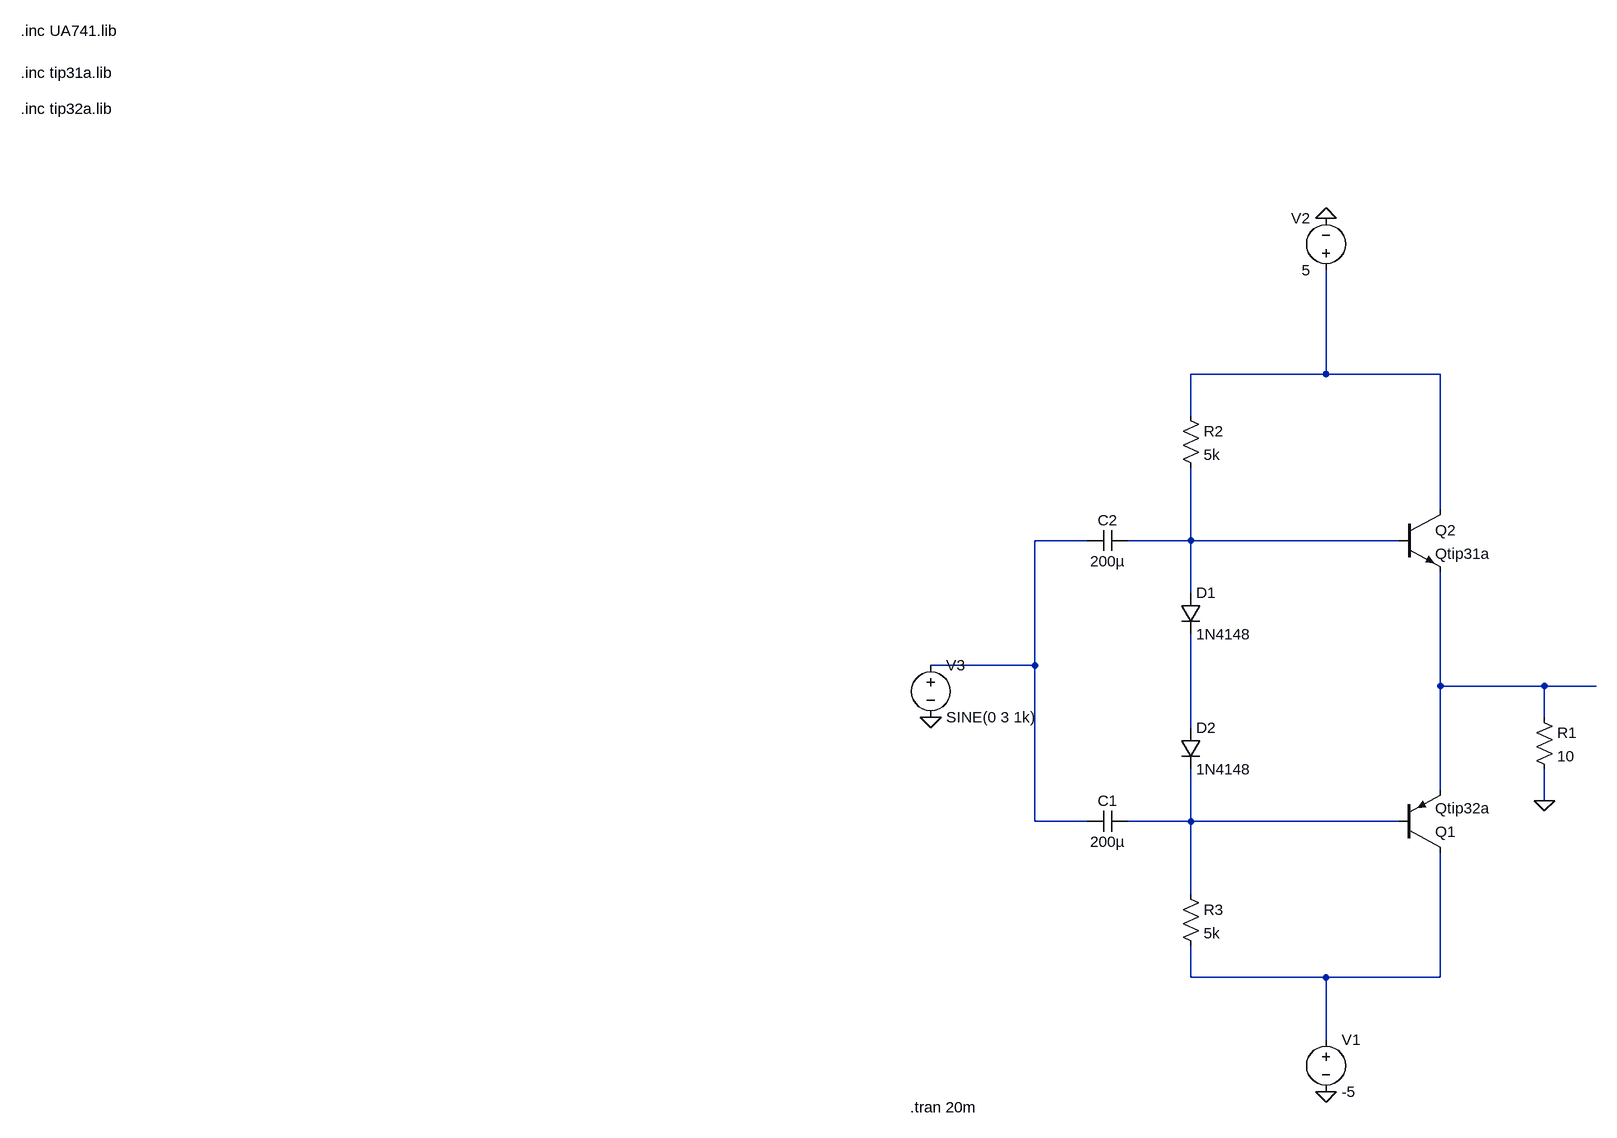
[diagram p0: schematic 4th-stage(pow_amp).asc]
4th-stage(pow_amp).asc, the LTspice schematic file:
Version 4.1
SHEET 1 880 808
WIRE 240 -336 240 -496
WIRE 240 -336 32 -336
WIRE 416 -336 240 -336
WIRE 32 -272 32 -336
WIRE 416 -128 416 -336
WIRE -128 -80 -208 -80
WIRE 32 -80 32 -192
WIRE 32 -80 -64 -80
WIRE 352 -80 32 -80
WIRE 32 0 32 -80
WIRE -208 112 -208 -80
WIRE -208 112 -368 112
WIRE 416 144 416 -32
WIRE 576 144 416 144
WIRE 656 144 576 144
WIRE 576 192 576 144
WIRE 32 208 32 64
WIRE 416 304 416 144
WIRE 576 320 576 272
WIRE -208 352 -208 112
WIRE -128 352 -208 352
WIRE 32 352 32 272
WIRE 32 352 -64 352
WIRE 352 352 32 352
WIRE 32 464 32 352
WIRE 32 592 32 544
WIRE 240 592 32 592
WIRE 416 592 416 400
WIRE 416 592 240 592
WIRE 240 688 240 592
FLAG 576 320 0
FLAG 240 -576 0
FLAG 240 768 0
FLAG -368 192 0
SYMBOL pnp 352 400 M180
SYMATTR InstName Q1
SYMATTR Value Qtip32a
SYMBOL npn 352 -128 R0
SYMATTR InstName Q2
SYMATTR Value Qtip31a
SYMBOL res 560 176 R0
SYMATTR InstName R1
SYMATTR Value 10
SYMBOL res 16 -288 R0
SYMATTR InstName R2
SYMATTR Value 5k
SYMBOL res 16 448 R0
SYMATTR InstName R3
SYMATTR Value 5k
SYMBOL diode 16 0 R0
SYMATTR InstName D1
SYMATTR Value 1N4148
SYMBOL diode 16 208 R0
SYMATTR InstName D2
SYMATTR Value 1N4148
SYMBOL cap -64 336 R90
WINDOW 0 0 32 VBottom 2
WINDOW 3 32 32 VTop 2
SYMATTR InstName C1
SYMATTR Value 200µ
SYMBOL cap -64 -96 R90
WINDOW 0 0 32 VBottom 2
WINDOW 3 32 32 VTop 2
SYMATTR InstName C2
SYMATTR Value 200µ
SYMBOL voltage 240 672 R0
SYMATTR InstName V1
SYMATTR Value -5
SYMBOL voltage 240 -480 R180
WINDOW 0 24 96 Left 2
WINDOW 3 24 16 Left 2
SYMATTR InstName V2
SYMATTR Value 5
SYMBOL voltage -368 96 R0
WINDOW 123 0 0 Left 0
WINDOW 39 0 0 Left 0
SYMATTR InstName V3
SYMATTR Value SINE(0 3 1k)
TEXT -400 792 Left 2 !.tran 20m
TEXT -1768 -864 Left 2 !.inc UA741.lib
TEXT -1768 -800 Left 2 !.inc tip31a.lib
TEXT -1768 -744 Left 2 !.inc tip32a.lib

The netlist it stands for:
* 4th-stage(pow_amp).asc
Q1 N007 N006 N004 0 Qtip32a
Q2 N001 N003 N004 0 Qtip31a
R1 N004 0 10
R2 N001 N003 5k
R3 N006 N007 5k
D1 N003 N005 1N4148
D2 N005 N006 1N4148
C1 N006 N002 200µ
C2 N003 N002 200µ
V1 N007 0 -5
V2 N001 0 5
V3 N002 0 SINE(0 3 1k)
.model D D
.lib standard.dio
.model NPN NPN
.model PNP PNP
.lib standard.bjt
.tran 20m
.inc UA741.lib
.inc tip31a.lib
.inc tip32a.lib
.backanno
.end